# EAGLE schematic Schematic (EAGLE 9.7.0)
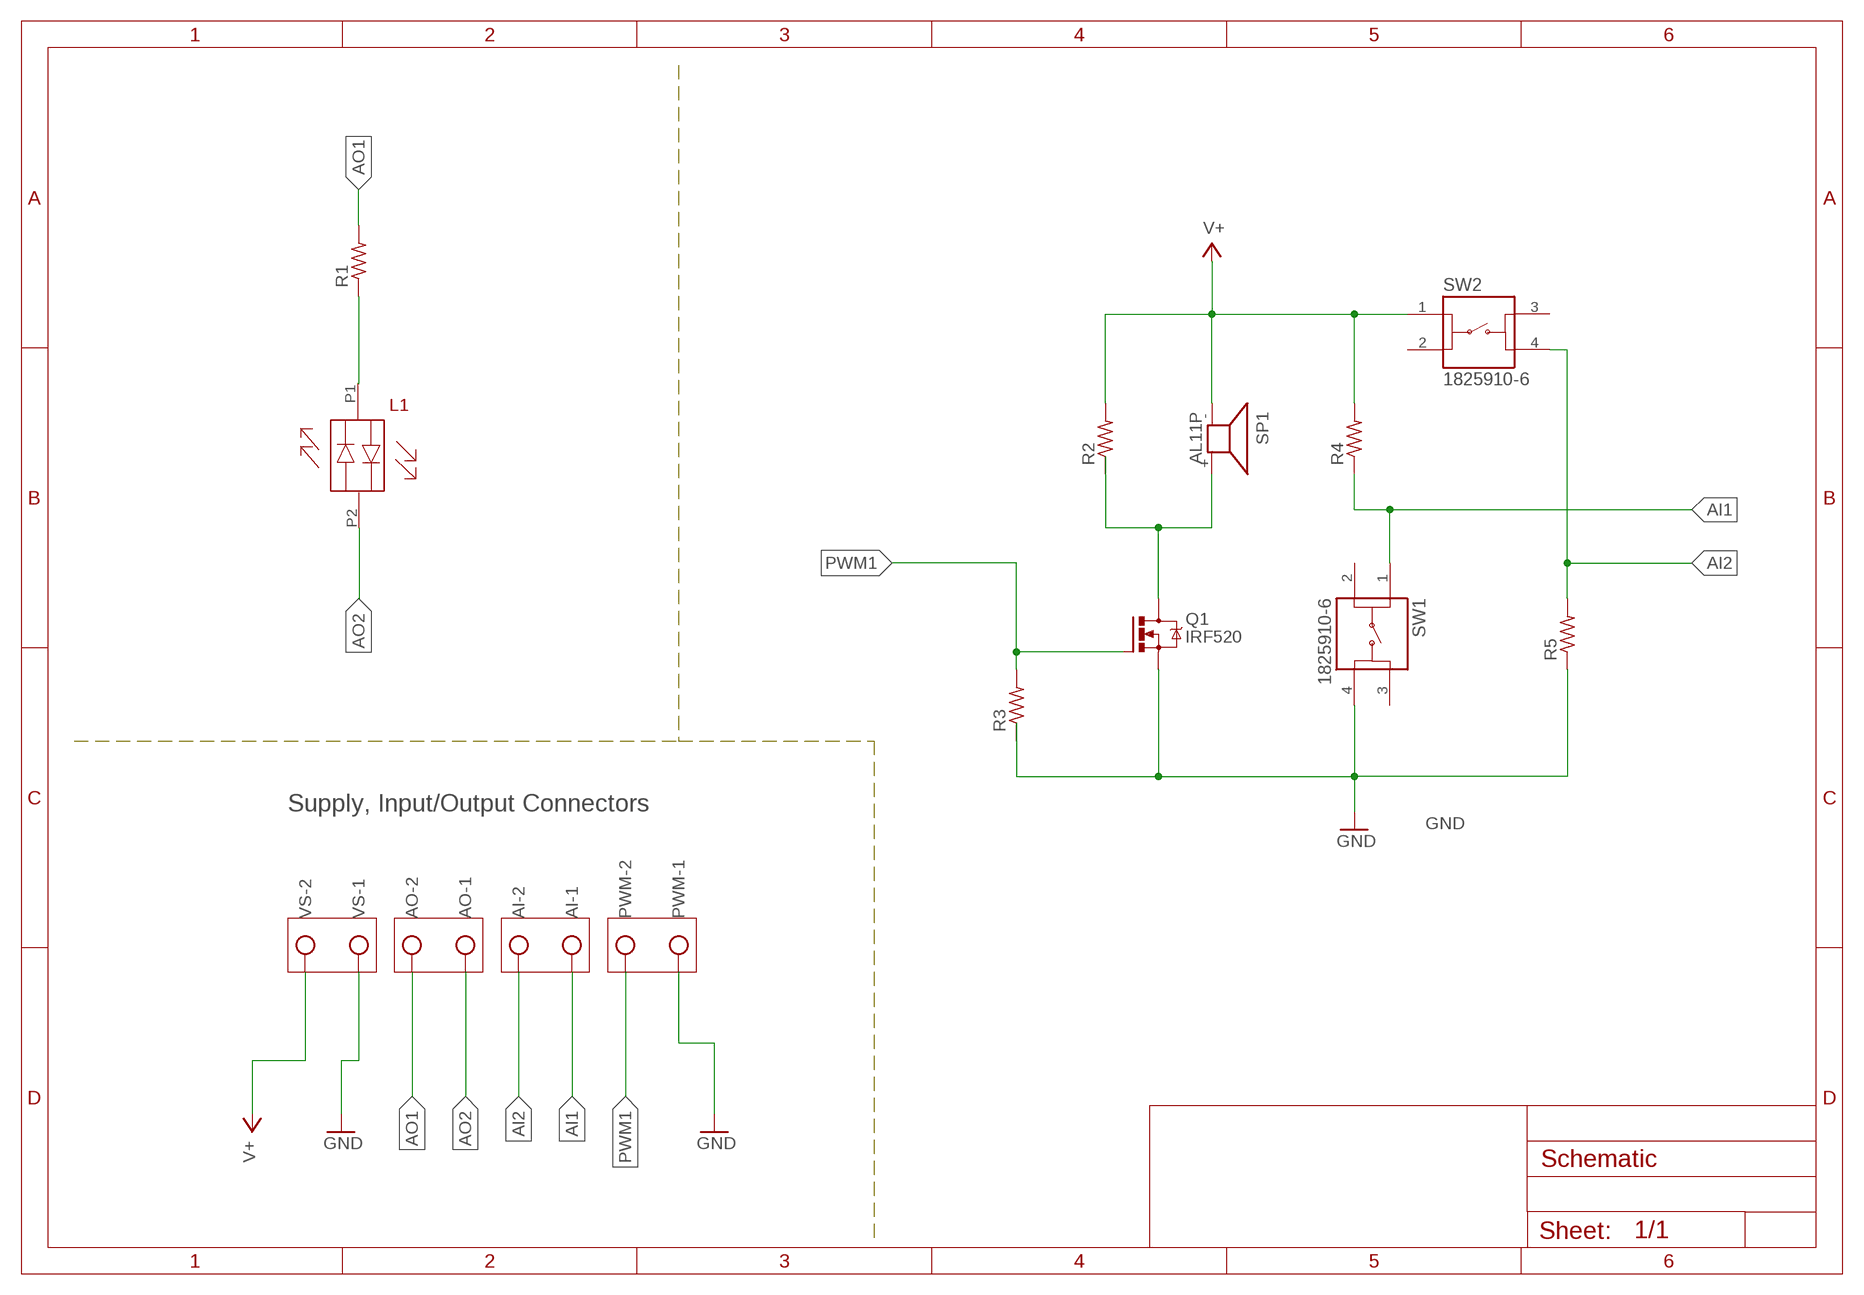
[diagram p0: schematic, sheet 1]

## Parts
AI  W237-102  [W237-102]
AO  W237-102  [W237-102]
PWM  W237-102  [W237-102]
Q1  IRF520  NMOSFET_IRF520_TO220  [TO220BV]
R1  R-US_0207/10  [0207/10]
R2  R-US_0207/10  [0207/10]
R3  R-US_0207/10  [0207/10]
R4  R-US_0207/10  [0207/10]
R5  R-US_0207/10  [0207/10]
SP1  AL11P  [AL11P]
SW1  1825910-6  [1825910-6]
SW2  1825910-6  [1825910-6]
U$1  BI-LED  [BI-LED]
VS  W237-102  [W237-102]

## Nets
AI1: AI.1 R4.1 SW1.1
AI2: AI.2 R5.2 SW2.4
AO1: AO.2 R1.2
AO2: AO.1 U$1.P2
GND: PWM.1 Q1.S R3.1 R5.1 SW1.4 VS.1
N$2: R1.1 U$1.P1
N$9: Q1.D R2.1 SP1.+
PWM1: PWM.2 Q1.G R3.2
V+: R2.2 R4.2 SP1.- SW2.1 VS.2
Unconnected: SW1.2 SW1.3 SW2.2 SW2.3

## Notes on the sheet
- Supply, Input/Output Connectors

## Library data of the parts
AI AO PWM VS = con-wago-500_editable:W237-102: WAGO SCREW CLAMP; MPN: 237-102; OC_FARNELL: unknown; OC_NEWARK: 70K9898
Q1 = Transistor:NMOSFET_: N-Channel MOSFET - Popular parts; CATEGORY: Transistor; DESCRIPTION: MOSFET N-CH 100V 9.7A TO-220AB; DRAIN_CURRENT: 9.7A; MANUFACTURER: Infineon Technologies; MPN: IRF520NPBF; OPERATING_TEMP: -55°C ~ 175°C; PART_STATUS: Active; ROHS_COMPLIANT: Yes; SUB-CATEGORY: MOSFET; THERMALLOSS: 48W; TYPE: N-Channel
R1-R5 = rcl:R-US_: RESISTOR, American symbol; SPICEPREFIX: R
SP1 = buzzer-editable:AL11P: SPEAKER Source: Buerklin; OC_FARNELL: unknown; OC_NEWARK: unknown
SW1 SW2 = Switch:1825910-6: SWITCH TACTILE SPST-NO 0.05A 24V Manufacturer's datasheet <https://www.te.com/commerce/DocumentDelivery/DDEController?Action=srchrtrv&DocNm=1825910&DocType=Customer+Drawing&DocLang=English>; CREATED_BY: PCBLayout.com; DIGIKEY_PART_NUMBER: 450-1650-ND; MANUFACTURER: TE Connectivity ALCOSWITCH Switches; MPN: 1825910-6
U$1 = Bi-LED:BI-LED